# Altium schematic sheet 03. Power.SchDoc
size A4
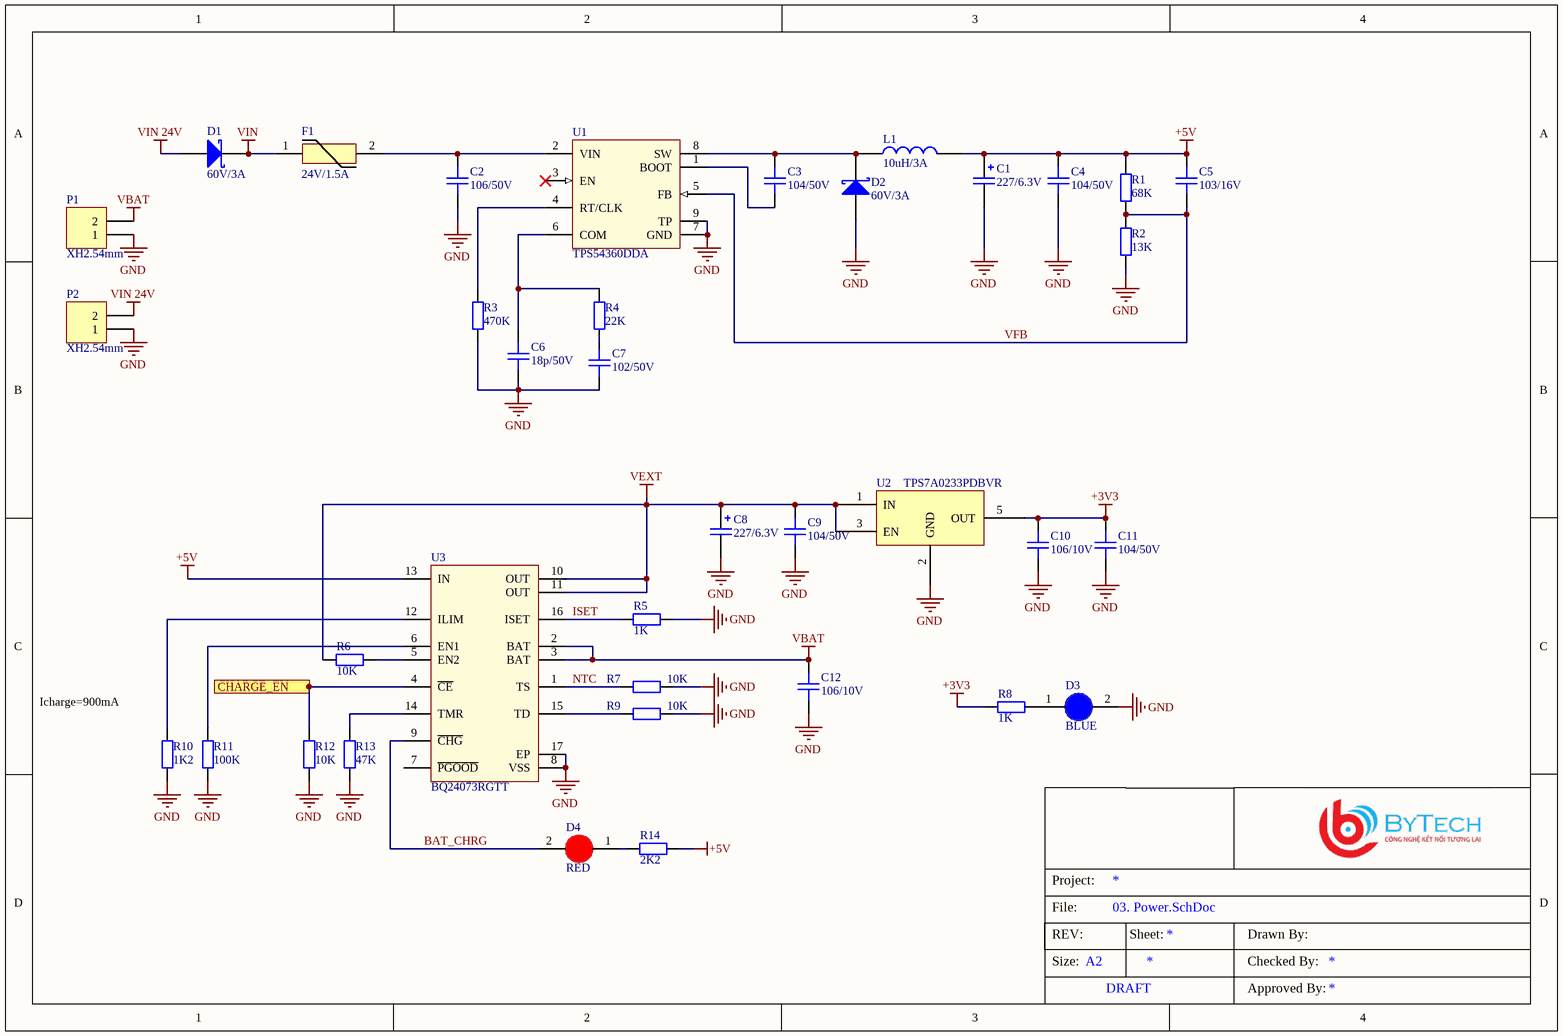
[diagram p0: 03. Power.SchDoc]

## Parts
C1  227/6.3V  [CAP_TANTAL_1210(3528)]
C2  106/50V  [CAPC-1210 (3225)]
C3  104/50V  [CAPC-0603 (1608)]
C4  104/50V  [CAPC-0603 (1608)]
C5  103/16V  [CAPC-0603 (1608)]
C6  18p/50V  [CAPC-0603 (1608)]
C7  102/50V  [CAPC-0603 (1608)]
C8  227/6.3V  [CAP_TANTAL_1210(3528)]
C9  104/50V  [CAPC-0603 (1608)]
C10  106/10V  [CAPC-0603 (1608)]
C11  104/50V  [CAPC-0603 (1608)]
C12  106/10V  [CAPC-0603 (1608)]
D1  60V/3A  [DIODE_DO214AC_SMA]
D2  60V/3A  [DIODE_DO214AC_SMA]
D3  BLUE  [LED 0603]
D4  RED  [LED 0603]
F1  24V/1.5A  [FUSE_1812(4532)]
L1  10uH/3A  [IND-IHLP2525-6.86X6.47MM]
P1  XH2.54mm  [XH2.54-2P]
P2  XH2.54mm  [XH2.54-2P]
R1  68K  [RESC-0603 (1608)]
R2  13K  [RESC-0603 (1608)]
R3  470K  [RESC-0603 (1608)]
R4  22K  [RESC-0603 (1608)]
R5  1K  [RESC-0603 (1608)]
R6  10K  [RESC-0603 (1608)]
R7  10K  [RESC-0603 (1608)]
R8  1K  [RESC-0603 (1608)]
R9  10K  [RESC-0603 (1608)]
R10  1K2  [RESC-0603 (1608)]
R11  100K  [RESC-0603 (1608)]
R12  10K  [RESC-0603 (1608)]
R13  47K  [RESC-0603 (1608)]
R14  2K2  [RESC-0603 (1608)]
U1  TPS54360DDA  [DDA8_3P1X2P4]
U2  TPS7A0233PDBVR  [SOT23-5]
U3  BQ24073RGTT  [RGT16-1700X1700TP]

## Ports
CHARGE_EN (in)

## Nets
+3V3: C10.2 C11.2 R8.1 U2.5(OUT)
+5V: C1.1 C4.2 C5.2 L1.2 R1.2 R14.2 U3.13(IN)
GND: C1.2 C2.1 C4.1 C6.1 C7.1 C8.2 C9.1 C10.1 C11.1 C12.1 D2.1(A) D3.2(K) P1.1 P2.1 R2.1 R3.1 R5.2 R7.2 R9.2 R10.1 R11.1 R12.1 R13.1 U1.7(GND) U1.9(TP) U2.2(GND) U3.8(VSS) U3.17(EP)
VBAT: C12.2 P1.2 U3.2(BAT) U3.3(BAT)
VEXT: C8.1 C9.2 R6.1 U2.1(IN) U2.3(EN) U3.10(OUT) U3.11(OUT)
VIN: D1.2(K) F1.1
VIN 24V: D1.1(A) P2.2
BAT_CHRG: D4.2(K) U3.9(~{CHG})
CHARGE_EN: R12.2 U3.4(~{CE}) ; port CHARGE_EN
ISET: R5.1 U3.16(ISET)
NTC: R7.1 U3.1(TS)
VFB: C5.1 R1.1 R2.2 U1.5(FB)
NetC2_2: C2.2 F1.2 U1.2(VIN)
NetC3_1: C3.1 D2.2(K) L1.1 U1.8(SW)
NetC3_2: C3.2 U1.1(BOOT)
NetC6_2: C6.2 R4.2 U1.6(COM)
NetC7_2: C7.2 R4.1
NetD3_1: D3.1(A) R8.2
NetD4_1: D4.1(A) R14.1
NetR3_2: R3.2 U1.4(RT/CLK)
NetR6_2: R6.2 U3.5(EN2)
NetR9_1: R9.1 U3.15(TD)
NetR10_2: R10.2 U3.12(ILIM)
NetR11_2: R11.2 U3.6(EN1)
NetR13_2: R13.2 U3.14(TMR)

Not connected (* = marked no-connect by the designer): U1 3(EN)*; U3 7(~{PGOOD})

## Notes on the sheet
- (near R10) Icharge=900mA
- File:
- Project:
- REV:
- Size:
- A2
- Sheet:
- Drawn By:
- Checked By:
- DRAFT
- Approved By:

## Library data of the parts
C1 = T520B227M006ATE035: CAP TANT POLY 220uF 20% 6.3V 3528 35mOhm ESR; Solder: SMT; CompanyID: VT-00643; Value: 227/6.3V; MPN: T520B227M006ATE035
C2 = GRM32ER71H106KA12L: CAP CER 10uF 10% 50V X7R 1210 (3255); CompanyID: VT-01019; Solder: SMT; Value: 106/50V; MPN: GRM32ER71H106KA12L; Category: CAPACITOR
C3 C4 C9 C11 = C0603C104K5RACTU: CAP CER 0.1uF 50V 10% X7R 0603; CompanyID: VT-00982; Solder: SMT; MPN: C0603C104K5RACTU; Value: 104/50V; Category: CAPACITOR
C5 = CC0603KRX7R7BB103: CAP CER 10nF 16V 10% X7R 0603; CompanyID: VT-00592; Solder: SMT; MPN: CC0603KRX7R7BB103; Value: 103/16V; Category: CAPACITOR
C6 = CL10C180JB8NNNC: CAP CER 18pF 5% 50V C0G/NP0 0603; CompanyID: VT-00985; Solder: SMT; Value: 18p/50V; MPN: CL10C180JB8NNNC; Category: CAPACITOR
C7 = C0603C102K5RACTU: CAP CER 1nF 50V 10% X7R 0603; CompanyID: VT-00573; Solder: SMT; MPN: C0603C102K5RACTU; Value: 102/50V; Category: CAPACITOR
C8 = T520B227M006ATE035: CAP TANT POLY 220uF 20% 6.3V 3528 35mOhm ESR; Solder: SMT; Company ID: VT00099; Value: 227/6.3V; MPN: T520B227M006ATE035
C10 = CL10A106KP8NNNC: CAP CER 10uF 10% 10V X5R 0603; Solder: SMT; MPN: CL10A106KP8NNNC; Value: 106/10V
C12 = CL10A106KP8NNNC: CAP CER 10uF 10% 10V X5R 0603; CompanyID: VT-00984; Solder: SMT; MPN: CL10A106KP8NNNC; Value: 106/10V
D1 = SK36A-LTP: DIODE SCHOTTKY 60V 3A DO214AC; MPN: SK36A-LTP; Category: Diode; Solder: DO214AC; Value: 60V/3A
D2 = SK36A-LTP: DIODE SCHOTTKY 60V 3A DO214AC; Manufacturer: Micro Commercial Co; MPN: SK36A-LTP; Category: Diode; Solder: DO214AC; Value: 60V/3A
D3 = LED 0603 BLUE: Solder: 0603; Company ID: VT00356; MPN: LED 0603 BLUE; Category: LED Diode; Value: BLUE
D4 = LED 0603 RED: Solder: 0603; Company ID: VT00361; MPN: LED 0603 RED; Category: LED Diode; Value: RED
F1 = 1812L150/24MR: FUSE PTC RESETTABLE 24V 1.50A 1812L; Solder: SMT; MPN: 1812L150/24MR; Value: 24V/1.5A
L1 = IHLP2525CZER100M01: IND-FIXED 10uH 3A 105 mOhm SMD; Solder: SMT; CompanyID: VT-01095; Value: 10uH/3A; MPN: IHLP2525CZER100M01; Category: INDUCTOR
P1 P2 = XH-2A: XH2.54mmm - 2P 180 degree; MPN: XH-2A; Value: XH2.54mm
R1 = CRCW060368K0FKEA: RES SMD 68K OHM 1% 1/10W 0603; Solder: SMT; MPN: CRCW060368K0FKEA; Value: 68K
R2 = AC0603FR-0713KL: RES SMD 13K OHM 1% 1/10W 0603; Solder: SMT; MPN: AC0603FR-0713KL; Value: 13K
R3 = RC0603FR-07470KL: RES SMD 470K OHM 1% 1/10W 0603; Solder: SMT; Value: 470K; MPN: RC0603FR-07470K; Category: RESISTOR
R4 = RC0603FR-0722KL: RES SMD 22K OHM 1% 1/10W 0603; Solder: SMT; CompanyID: VT-00320; Value: 22K; MPN: RC0603FR-0722KL; Category: RESISTOR
R5 R8 = RC0603FR-071KL: RES SMD 1 KOHM 1% 1/10W 0603; Solder: SMT; Company ID: VT00433; MPN: RC0603FR-071KL; Value: 1K
R6 R7 R9 R12 = RC0603FR-0710KL: RES SMD 10K OHM 1% 1/10W 0603; CompanyID: VT-00328; Solder: SMT; MPN: RC0603FR-0710KL; Value: 10K
R10 = RC0603FR-071K2L: RES SMD 1.2K OHM 1% 1/10W 0603; CompanyID: VT-01075; Solder: SMT; Value: 1K2; MPN: RC0603FR-071K2L
R11 = RC0603FR-07100KL: RES SMD 100K OHM 1% 1/10W 0603; Solder: SMT; CompanyID: VT-00332; MPN: RC0603FR-07100KL; Value: 100K
R13 = RC0603FR0747KL: RES SMD 47K OHM 1% 1/10W 0603; CompanyID: VT-00322; Solder: SMT; Value: 47K; MPN: RC0603FR0747KL
R14 = CRCW06032K20FKEA: RES SMD 2.2K OHM 1% 1/10W 0603; Solder: SMT; Company ID: VT00406; MPN: CRCW06032K20FKEA; Value: 2K2
U1 = TPS54360DDA: IC REG BCK SPLIT RAIL ADJ 8SOPWR; Manufacturer: Texas Instruments; VALUE: TPS54360DDA; MPN: TPS54360DDA
U2 = TPS7A0233PDBVR: NANOPOWER LDO; Current - Quiescent: 60nA; MPN: TPS7A0233PDBVR; Category: IC; Solder: SOT23-5; Value: TPS7A0233PDBVR
U3 = BQ24073RGTT: IC LI-ION CHARGE/PWR MGMT 16-QFN; MFR: Texas Instruments; Solder: 16-QFN (3x3); Company ID: VT00206; MPN: BQ24073RGTT; Category: IC; Value: BQ24073RGTT